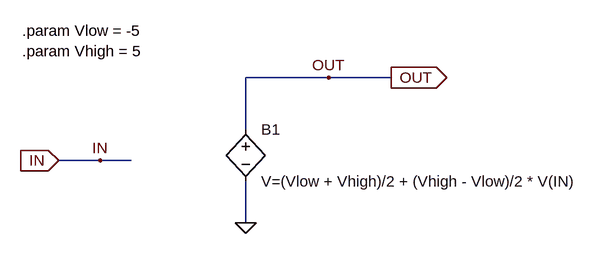
[diagram p0: schematic Range.asc]
Range.asc, the LTspice schematic file:
Version 4
SHEET 1 1128 680
WIRE 352 112 224 112
WIRE 448 112 352 112
WIRE 224 192 224 112
WIRE 0 240 -64 240
WIRE 48 240 0 240
WIRE 224 336 224 272
FLAG 224 336 0
FLAG -64 240 IN
IOPIN -64 240 In
FLAG 448 112 OUT
IOPIN 448 112 Out
FLAG 0 240 IN
FLAG 352 112 OUT
SYMBOL bv 224 176 R0
SYMATTR InstName B1
SYMATTR Value V=(Vlow + Vhigh)/2 + (Vhigh - Vlow)/2 * V(IN)
TEXT -120 40 Left 2 !.param Vlow = -5\n.param Vhigh = 5

The netlist it stands for:
* Range.asc
B1 OUT 0 V=(Vlow + Vhigh)/2 + (Vhigh - Vlow)/2 * V(IN)
.param Vlow = -5
.param Vhigh = 5
.backanno
.end